# EAGLE design board (EAGLE 7.7.0)
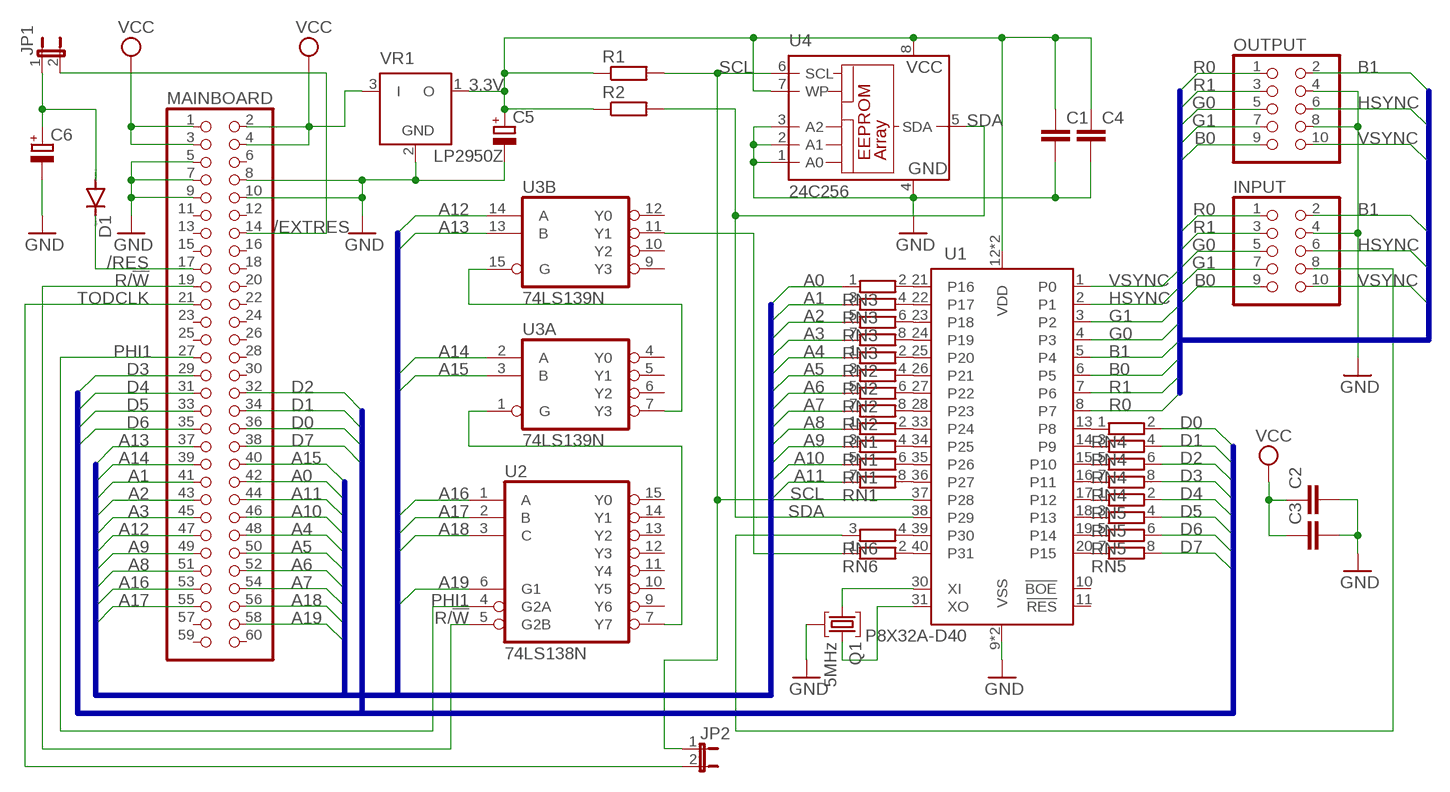
[diagram p0: schematic, sheet 1]

## Parts
C1  C2.5/2  [C2.5-2]
C2  C2.5/2  [C2.5-2]
C3  C2.5/2  [C2.5-2]
C4  C2.5/2  [C2.5-2]
C5  CPOL-EUE5-6  [E5-6]
C6  CPOL-EUE5-6  [E5-6]
D1  1N4148DO35-7  [DO35-7]
INPUT  PINHD-2X5  [2X05]
JP1  JP1E  [JP1]
JP2  JP1E  [JP1]
MAINBOARD  PINHD-2X30  [2X30]
OUTPUT  PINHD-2X5  [2X05]
Q1  5MHz  16M20AUM1  [UM1]
R1  R-EU_0204/7  [0204/7]
R2  R-EU_0204/7  [0204/7]
RN1  E4RP  [SIL8]
RN2  E4RP  [SIL8]
RN3  E4RP  [SIL8]
RN4  E4RP  [SIL8]
RN5  E4RP  [SIL8]
RN6  E4RP  [SIL8]
U1  P8X32A-D40  [DIL40]
U2  74LS138N  [DIL16]
U3  74LS139N  [DIL16]
U4  24C256  24C64P  [DIL8]
VR1  LP2950Z  [TO92]

## Nets
3.3V [power]: C1.1 C4.1 C5.+ R1.1 R2.1 U1.12(VDD) U1.32(VDD) U4.7(WP) U4.8(VCC) VR1.1(O)
/EXTRES: JP1.2 MAINBOARD.14
/RES: D1.C MAINBOARD.17
A0: MAINBOARD.42 RN3.1
A1: MAINBOARD.41 RN3.3
A2: MAINBOARD.43 RN3.5
A3: MAINBOARD.45 RN3.7
A4: MAINBOARD.48 RN2.1
A5: MAINBOARD.50 RN2.3
A6: MAINBOARD.52 RN2.5
A7: MAINBOARD.54 RN2.7
A8: MAINBOARD.51 RN1.1
A9: MAINBOARD.49 RN1.3
A10: MAINBOARD.46 RN1.5
A11: MAINBOARD.44 RN1.7
A12: MAINBOARD.47 U3.14(B:A)
A13: MAINBOARD.37 U3.13(B:B)
A14: MAINBOARD.39 U3.2(A:A)
A15: MAINBOARD.40 U3.3(A:B)
A16: MAINBOARD.53 U2.1(A)
A17: MAINBOARD.55 U2.2(B)
A18: MAINBOARD.56 U2.3(C)
A19: MAINBOARD.58 U2.6(G1)
B0: INPUT.9 OUTPUT.9 U1.6(P5)
B1: INPUT.2 OUTPUT.2 U1.5(P4)
D0: MAINBOARD.36 RN4.2
D1: MAINBOARD.34 RN4.4
D2: MAINBOARD.32 RN4.6
D3: MAINBOARD.29 RN4.8
D4: MAINBOARD.31 RN5.2
D5: MAINBOARD.33 RN5.4
D6: MAINBOARD.35 RN5.6
D7: MAINBOARD.38 RN5.8
G0: INPUT.5 OUTPUT.5 U1.4(P3)
G1: INPUT.7 OUTPUT.7 U1.3(P2)
GND [power]: C1.2 C2.2 C3.2 C4.2 C5.- C6.- INPUT.4 MAINBOARD.5 MAINBOARD.7 MAINBOARD.8 MAINBOARD.9 MAINBOARD.10 OUTPUT.4 OUTPUT.8 Q1.2 U1.9(VSS) U1.29(VSS) U4.1(A0) U4.2(A1) U4.3(A2) U4.4(GND) VR1.2(GND)
HSYNC: INPUT.6 OUTPUT.6 U1.2(P1)
N$1: U2.7(Y7) U3.1(A:G)
N$2: U3.7(A:Y3) U3.15(B:G)
N$3: RN6.1 U3.11(B:Y1)
N$4: RN1.8 U1.36(P27)
N$5: RN1.6 U1.35(P26)
N$6: RN1.4 U1.34(P25)
N$7: RN1.2 U1.33(P24)
N$8: RN2.8 U1.28(P23)
N$9: RN2.6 U1.27(P22)
N$10: RN2.4 U1.26(P21)
N$11: RN2.2 U1.25(P20)
N$12: RN3.8 U1.24(P19)
N$13: RN3.6 U1.23(P18)
N$14: RN3.4 U1.22(P17)
N$15: RN3.2 U1.21(P16)
N$16: RN5.7 U1.20(P15)
N$17: RN5.5 U1.19(P14)
N$18: RN5.3 U1.18(P13)
N$19: RN5.1 U1.17(P12)
N$20: RN4.7 U1.16(P11)
N$21: RN4.5 U1.15(P10)
N$22: RN4.3 U1.14(P9)
N$23: RN4.1 U1.13(P8)
N$24: RN6.2 U1.40(P31)
N$25: RN6.4 U1.39(P30)
N$26: Q1.1 U1.30(XI)
N$27: Q1.3 U1.31(XO)
N$28: C6.+ D1.A JP1.1
N$29: INPUT.8 RN6.3
PHI1: MAINBOARD.27 U2.4(G2A)
R0: INPUT.1 OUTPUT.1 U1.8(P7)
R1: INPUT.3 OUTPUT.3 U1.7(P6)
R/!W: MAINBOARD.19 U2.5(G2B)
SCL: JP2.1 R1.2 U1.37(P28) U4.6(SCL)
SDA: R2.2 U1.38(P29) U4.5(SDA)
TODCLK: JP2.2 MAINBOARD.21
VCC [power]: C2.1 C3.1 MAINBOARD.1 MAINBOARD.2 MAINBOARD.3 MAINBOARD.4 VR1.3(I)
VSYNC: INPUT.10 OUTPUT.10 U1.1(P0)
Unconnected: MAINBOARD.6 MAINBOARD.11 MAINBOARD.12 MAINBOARD.13 MAINBOARD.15 MAINBOARD.16 MAINBOARD.18 MAINBOARD.20 MAINBOARD.22 MAINBOARD.23 MAINBOARD.24 MAINBOARD.25 MAINBOARD.26 MAINBOARD.28 MAINBOARD.30 MAINBOARD.57 MAINBOARD.59 MAINBOARD.60 RN6.5 RN6.6 RN6.7 RN6.8 U1.10(!BOE) U1.11(!RES) U2.9(Y6) U2.10(Y5) U2.11(Y4) U2.12(Y3) U2.13(Y2) U2.14(Y1) U2.15(Y0) U3.4(A:Y0) U3.5(A:Y1) U3.6(A:Y2) U3.9(B:Y3) U3.10(B:Y2) U3.12(B:Y0)

## Buses
ADDR:A[0..19]
DATA:D[0..7]
VGA:B[0..1],G[0..1],HSYNC,R[0..1],VSYNC

## Power pins joined to a net without a drawn wire
GND: U2.8(GND) U3.8(P:GND)
VCC: U2.16(VCC) U3.16(P:VCC)

## Library data of the parts
C1-C4 = capacitor-wima:C: CAPACITOR naming: grid - package width
C5 C6 = rcl:CPOL-EU: POLARIZED CAPACITOR, European symbol; SPICEPREFIX: C
D1 = diode:1N4148: DIODE high speed (Philips)
INPUT OUTPUT = pinhead:PINHD-2X5: PIN HEADER
JP1 JP2 = jumper:JP1E: JUMPER
MAINBOARD = pinhead:PINHD-2X30: PIN HEADER
Q1 = crystal:16M20AUM1: Monolithic Crystal Filters Source: www.vanlong.com; OC_FARNELL: unknown; OC_NEWARK: unknown
R1 R2 = resistor:R-EU_: RESISTOR, European symbol
RN1-RN6 = resistor-sil:E4RP: SIL RESISTOR; OC_FARNELL: unknown; OC_NEWARK: unknown
U1 = p8x32a_11:P8X32A-?: 8-Cog Multiprocessor Microcontroller Source: http://www.parallax.com/sites/default/files/downloads/P8X32A-Propeller-Datasheet-v1.4.0_0.pdf; MF: Parallax Semiconductor; MPN: P8X32A-D40; OC_FARNELL: 1263886; OC_NEWARK: 11X5686
U2 = 74xx-us:74*138: 3-line to 8-line DECODER/DEMULTIPLEXER
U3 = 74xx-us:74*139: Dual 2-line to 4-line DECODER/DEMULTIPLEXER
U4 = microchip:24*: Serial EEPROM I2C; MF: RAMTRON INTERNATIONAL CORP; MPN: FM24C64-P; OC_FARNELL: 1362657; OC_NEWARK: 97H6452
VR1 = linear:LP2950: 100 mA, Low Power Low Dropout Voltage Regulator Source: http://www.onsemi.com/pub/Collateral/LP2950-D.PDF

## Net classes
0 default: width 0.127 mm, drill 0.127 mm, clearance 0.127 mm
1 power: width 0.305 mm, drill 0.127 mm, clearance 0.127 mm

## Board
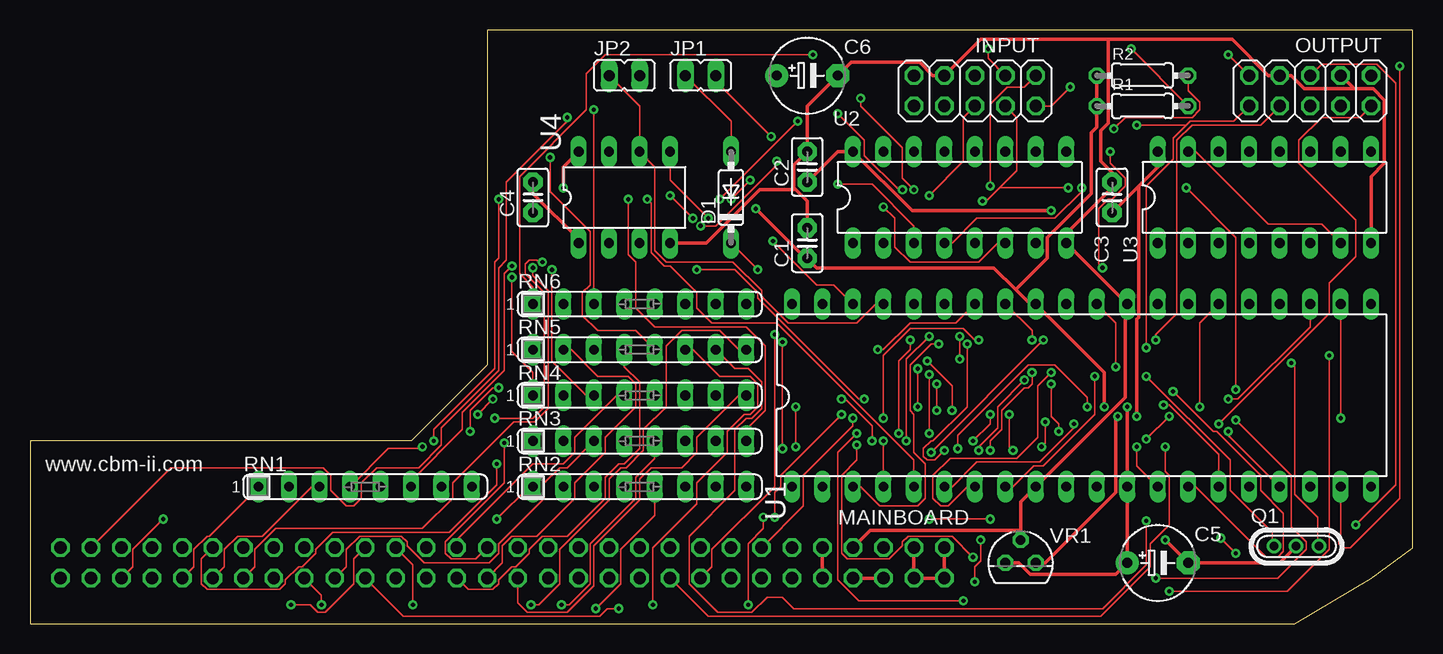
[diagram p1: board, top side]
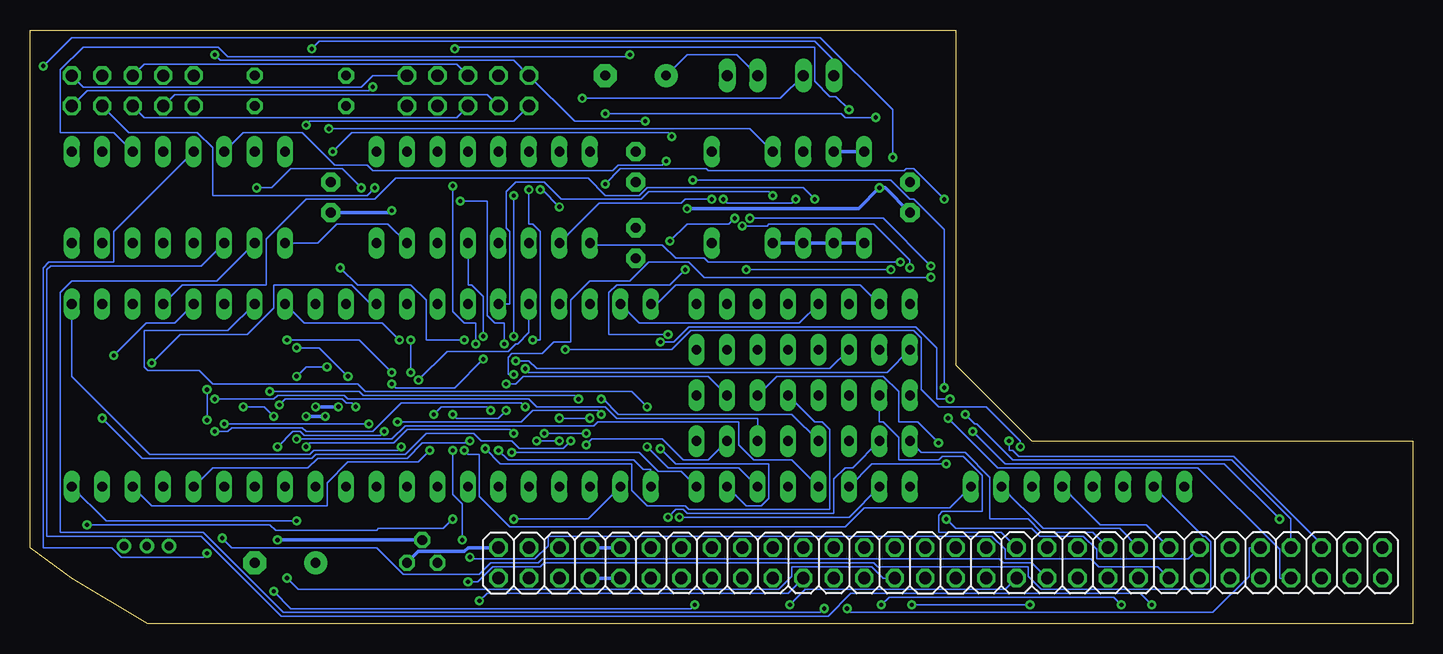
[diagram p2: board, bottom side, seen from below]

Size 115.24 x 49.52 mm. Coordinates in mm from the lower left corner, seen from the top.
Outline: 0,0 105.41,0 111.76,3.81 115.24,6.35 115.24,49.52 38.1,49.52 38.1,21.59 31.75,15.24 0,15.24 0,0
Copper layers (1*16): Top 0.035mm / dielectric 1.5mm / Bottom 0.035mm
Design rules "default *": minimum track width 5mil, minimum drill 0.35mm, track to track 5mil, track to pad 5mil, pad to pad 5mil, via to via 5mil, smd to smd 5mil, copper to edge 20mil, drill to drill 5mil, minimum pad ring 10mil, minimum via ring 8mil, stop-mask expansion 4mil, vias tented up to drill 0mil, thermal gap 10mil

### Footprints (pad centres in the part's own frame; a part is rotated, then mirrored left to right if it is on the bottom)
C2.5-2 = drill 0.813 pad 1.6 octagon: 1 -1.27,0; 2 1.27,0
E5-6 = drill 0.813 pad 1.905: + -2.54,0 | drill 0.813 pad 1.905 octagon: - 2.54,0
DO35-7 = drill 0.813 long: A 3.81,0; C -3.81,0
2X05 = drill 1.016 octagon: 1 -5.08,-1.27; 2 -5.08,1.27; 3 -2.54,-1.27; 4 -2.54,1.27; 5 0,-1.27; 6 0,1.27; 7 2.54,-1.27; 8 2.54,1.27; 9 5.08,-1.27; 10 5.08,1.27
JP1 = drill 0.914 long: 1 0,-1.27; 2 0,1.27
2X30 = drill 1.016 octagon: 1 -38.1,-1.27; 2 -38.1,1.27; 3 -35.56,-1.27; 4 -35.56,1.27; 5 -33.02,-1.27; 6 -33.02,1.27; 7 -30.48,-1.27; 8 -30.48,1.27; 9 -27.94,-1.27; 10 -27.94,1.27; 11 -25.4,-1.27; 12 -25.4,1.27; 13 -22.86,-1.27; 14 -22.86,1.27; 15 -20.32,-1.27; 16 -20.32,1.27; 17 -17.78,-1.27; 18 -17.78,1.27; 19 -15.24,-1.27; 20 -15.24,1.27; 21 -12.7,-1.27; 22 -12.7,1.27; 23 -10.16,-1.27; 24 -10.16,1.27; 25 -7.62,-1.27; 26 -7.62,1.27; 27 -5.08,-1.27; 28 -5.08,1.27; 29 -2.54,-1.27; 30 -2.54,1.27; 31 0,-1.27; 32 0,1.27; 33 2.54,-1.27; 34 2.54,1.27; 35 5.08,-1.27; 36 5.08,1.27; 37 7.62,-1.27; 38 7.62,1.27; 39 10.16,-1.27; 40 10.16,1.27; 41 12.7,-1.27; 42 12.7,1.27; 43 15.24,-1.27; 44 15.24,1.27; 45 17.78,-1.27; 46 17.78,1.27; 47 20.32,-1.27; 48 20.32,1.27; 49 22.86,-1.27; 50 22.86,1.27; 51 25.4,-1.27; 52 25.4,1.27; 53 27.94,-1.27; 54 27.94,1.27; 55 30.48,-1.27; 56 30.48,1.27; 57 33.02,-1.27; 58 33.02,1.27; 59 35.56,-1.27; 60 35.56,1.27
UM1 = drill 0.7 pad 1.2: 1 -1.875,0; 2 -0.027,0; 3 1.875,0
0204/7 = drill 0.813 octagon: 1 -3.81,0; 2 3.81,0
SIL8 = drill 0.813 long: 1 -8.89,0; 2 -6.35,0; 3 -3.81,0; 4 -1.27,0; 5 1.27,0; 6 3.81,0; 7 6.35,0; 8 8.89,0
DIL40 = drill 0.813 long: 1 -22.86,-7.62; 2 -20.32,-7.62; 3 -17.78,-7.62; 4 -15.24,-7.62; 5 -12.7,-7.62; 6 -10.16,-7.62; 7 -7.62,-7.62; 8 -5.08,-7.62; 9 -2.54,-7.62; 10 0,-7.62; 11 2.54,-7.62; 12 5.08,-7.62; 13 7.62,-7.62; 14 10.16,-7.62; 15 12.7,-7.62; 16 15.24,-7.62; 17 17.78,-7.62; 18 20.32,-7.62; 19 22.86,-7.62; 20 25.4,-7.62; 21 25.4,7.62; 22 22.86,7.62; 23 20.32,7.62; 24 17.78,7.62; 25 15.24,7.62; 26 12.7,7.62; 27 10.16,7.62; 28 7.62,7.62; 29 5.08,7.62; 30 2.54,7.62; 31 0,7.62; 32 -2.54,7.62; 33 -5.08,7.62; 34 -7.62,7.62; 35 -10.16,7.62; 36 -12.7,7.62; 37 -15.24,7.62; 38 -17.78,7.62; 39 -20.32,7.62; 40 -22.86,7.62
DIL16 = drill 0.813 long: 1 -8.89,-3.81; 2 -6.35,-3.81; 3 -3.81,-3.81; 4 -1.27,-3.81; 5 1.27,-3.81; 6 3.81,-3.81; 7 6.35,-3.81; 8 8.89,-3.81; 9 8.89,3.81; 10 6.35,3.81; 11 3.81,3.81; 12 1.27,3.81; 13 -1.27,3.81; 14 -3.81,3.81; 15 -6.35,3.81; 16 -8.89,3.81
DIL8 = drill 0.813 long: 1 -3.81,-3.81; 2 -1.27,-3.81; 3 1.27,-3.81; 4 3.81,-3.81; 5 3.81,3.81; 6 1.27,3.81; 7 -1.27,3.81; 8 -3.81,3.81
TO92 = drill 0.813 octagon: 1 -1.27,0; 2 0,1.905; 3 1.27,0

### Placement (x,y rotation side)
C1  64.77,31.75 90 top
C2  64.77,38.1 90 top
C3  90.17,35.56 90 top
C4  41.91,35.56 90 top
C5  93.98,5.08 0 top
C6  64.77,45.72 0 top
D1  58.42,35.56 90 top
INPUT  78.74,44.45 0 top
JP1  55.88,45.72 270 top
JP2  49.53,45.72 270 top
MAINBOARD  38.1,5.08 0 bottom
OUTPUT  106.68,44.45 0 top
Q1  105.54,6.48 0 top
R1  92.71,43.18 0 top
R2  92.71,45.72 0 top
RN1  27.94,11.43 0 top
RN2  50.8,11.43 0 top
RN3  50.8,15.24 0 top
RN4  50.8,19.05 0 top
RN5  50.8,22.86 0 top
RN6  50.8,26.67 0 top
U1  86.36,19.05 0 top
U2  77.47,35.56 0 top
U3  102.87,35.56 0 top
U4  49.53,35.56 0 top
VR1  82.55,5.08 0 top

### Tracks (layer width: path | path; a pad name or v marks a point on that pad's centre or on a via)
3.3V  (via drill 0.35)
  Top 0.305: VR1.1 82.39,5.08 83.34,4.13 90.49,4.13 C5.+ U1.12 v91.44,18.1 | v44.45,36.35 44.45,38.1 U4.8 | R2.1 R1.1 88.9,41.43 88.42,40.96 88.42,35.88 84.77,32.23 84.77,30.48 82.15,27.86 | 82.15,27.86 80.33,29.69 65.56,29.69 C1.1 64.77,30.32 v60.48,34.61 | 82.15,27.86 83.34,26.67 U1.32 89.53,20.95 v89.53,18.1
  Bottom 0.305: U4.7 U4.8 | C4.1 43.97,36.35 v44.45,36.35 46.2,34.61 v60.48,34.61 | v89.53,18.1 v91.44,18.1
/EXTRES  (via drill 0.35)
  Top 0.127: JP1.2 57.15,45.24 v61.75,40.64 | v90.01,39.37 90.01,38.42 91.28,37.15 91.28,36.51 90.17,35.4 89.85,35.4 89.06,34.61 89.06,30 v89.38,29.69 | v79.06,23.65 78.74,23.65 77.79,24.61 73.34,24.61 71.12,22.38 v71.12,17.14 | v68.58,17.14 68.58,16.51 64.45,12.38 64.45,9.84 MAINBOARD.14
  Bottom 0.127: v61.75,40.64 62.07,40.96 88.42,40.96 v90.01,39.37 | v89.38,29.69 87.95,28.26 83.5,28.26 82.23,26.99 82.23,23.65 v79.06,23.65 | v68.58,17.14 v71.12,17.14
/RES  (via drill 0.35)
  Top 0.127: v60.64,29.53 D1.C | v62.07,24.13 62.07,11.43 56.83,6.19 56.83,4.76 MAINBOARD.17
  Bottom 0.127: v60.64,29.53 61.91,28.26 66.36,28.26 66.99,27.62 66.99,24.13 v62.07,24.13
A0
  Bottom 0.127: RN3.1 40.96,14.29 37.31,14.29 35.24,12.22 35.24,8.73 32.07,8.73 30.96,7.62 26.67,7.62 MAINBOARD.42
A1
  Top 0.127: RN3.3 44.77,13.02 44.13,13.02 42.86,11.75 42.86,10.48 39.05,6.67 39.05,5.87 38.26,5.08 32.86,5.08 31.43,6.51 31.43,6.83 30.96,7.3 27.46,7.3 26.35,6.19 26.35,4.76 MAINBOARD.41
A2  (via drill 0.35)
  Top 0.127: RN3.5 52.07,13.81 50.48,12.22 50.48,10.48 46.67,6.67 46.67,3.33 44.93,1.59 v44.29,1.59 | v24.29,1.59 24.29,2.38 MAINBOARD.43
  Bottom 0.127: v44.29,1.59 43.66,2.22 24.92,2.22 v24.29,1.59
A3  (via drill 0.35)
  Top 0.127: v68.9,14.92 68.9,13.65 67.63,12.38 67.63,5.87 68.1,5.4 71.6,5.4 72.71,6.51 72.71,6.83 73.18,7.3 76.83,7.3 v78.58,5.56
  Bottom 0.127: RN3.7 58.74,13.65 60.8,13.65 62.55,15.4 68.42,15.4 v68.9,14.92 | v78.58,5.56 78.42,5.4 73.18,5.4 72.07,6.51 72.07,7.3 35.08,7.3 33.97,6.19 33.97,5.4 26.83,5.4 26.19,4.76 21.27,4.76 MAINBOARD.45
A4  (via drill 0.35)
  Top 0.127: RN2.1 41.59,11.43 v38.89,8.73
  Bottom 0.127: v38.89,8.73 38.1,7.94 31.75,7.94 31.11,7.3 27.46,7.3 26.35,6.19 26.35,5.4 18.73,5.4 MAINBOARD.48
A5  (via drill 0.35)
  Top 0.127: v38.89,13.33 38.89,11.59 34.92,7.62 25.24,7.62 23.81,6.19 23.81,5.87 22.7,4.76 22.38,4.76 21.27,3.65 21.27,3.33 20.8,2.86 14.76,2.86 14.29,3.33 14.29,5.4 MAINBOARD.50
  Bottom 0.127: RN2.3 45.09,13.33 v38.89,13.33
A6  (via drill 0.35)
  Top 0.127: RN2.5 52.07,9.05 49.21,6.19 49.21,3.33 v47.15,1.27
  Bottom 0.127: v47.15,1.27 46.83,0.95 16.67,0.95 13.65,3.97 13.65,6.35 MAINBOARD.52
A7  (via drill 0.35)
  Top 0.127: v62.71,23.5 v62.71,14.61 | v37.31,17.46 v38.58,18.73
  Bottom 0.127: RN2.7 55.56,9.84 54.29,9.84 53.66,10.48 53.66,13.33 61.44,13.33 v62.71,14.61 | v62.71,23.5 61.59,23.5 60.33,24.77 41.43,24.77 39.69,23.02 39.69,18.73 v38.58,18.73 | v37.31,17.46 36.51,16.67 36.35,16.67 33.34,13.65 15.08,13.65 10.16,8.73 MAINBOARD.54
A8
  Top 0.127: RN1.1 14.92,7.3 14.76,7.3 13.65,6.19 13.65,4.76 MAINBOARD.51
A9
  Top 0.127: RN1.3 23.5,11.43 19.37,7.3 17.3,7.3 16.19,6.19 16.19,4.76 MAINBOARD.49
A10
  Bottom 0.127: RN1.5 26.04,8.26 22.23,8.26 MAINBOARD.46
A11
  Bottom 0.127: RN1.7 30.8,7.94 24.45,7.94 MAINBOARD.44
A12  (via drill 0.35)
  Top 0.127: v62.23,38.58 62.23,38.26 57.15,33.18 v55.88,33.18 | v41.91,29.69 41.91,29.05 43.18,27.78 43.18,17.94 42.07,16.83 40.32,16.83 35.24,11.75 35.24,10.48 32.7,7.94 20.48,7.94 18.73,6.19 18.73,4.76 MAINBOARD.47
  Bottom 0.127: U3.14 97.47,40.96 92.55,40.96 89.85,38.26 87.15,38.26 86.68,37.78 66.67,37.78 66.2,38.26 62.55,38.26 v62.23,38.58 | v55.88,33.18 53.82,33.18 53.66,33.34 44.93,33.34 41.91,30.32 v41.91,29.69
A13  (via drill 0.35)
  Top 0.127: v99.22,7.14 v100.49,5.87
  Bottom 0.127: U3.13 108.27,32.7 108.27,30.16 113.67,30.16 114.14,29.69 114.14,6.35 108.43,6.35 107.63,5.56 100.81,5.56 v100.49,5.87 | v99.22,7.14 98.42,6.35 86.36,6.35 84.14,4.13 77.79,4.13 76.83,5.08 72.87,5.08 72.55,5.4 34.45,5.4 34.13,5.08 31.75,5.08 MAINBOARD.37
A14  (via drill 0.35)
  Top 0.127: v49.05,1.27 48.1,1.27 47.47,0.64 31.11,0.64 MAINBOARD.39
  Bottom 0.127: U3.2 99.69,28.57 111.76,28.57 112.71,27.62 112.71,7.62 100.81,7.62 94.14,0.95 49.37,0.95 v49.05,1.27
A15  (via drill 0.35)
  Top 0.127: v21.75,1.59 23.34,1.59 23.97,0.95 24.61,0.95 26.99,3.33 26.99,5.4 MAINBOARD.40
  Bottom 0.127: U3.3 100.97,29.84 113.51,29.84 113.82,29.53 113.82,7.3 100.97,7.3 94.3,0.64 48.74,0.64 46.83,2.54 22.7,2.54 v21.75,1.59
A16  (via drill 0.35)
  Top 0.127: v42.7,30.16 42.39,30.16 42.23,30.32 41.59,30.32 41.27,30 41.27,29.21 42.86,27.62 42.86,18.1 41.91,17.14 v38.73,17.14
  Bottom 0.127: U2.1 68.42,31.59 62.55,31.59 61.44,30.48 59.05,30.48 58.74,30.16 v42.7,30.16 | v38.73,17.14 34.61,13.02 17.94,13.02 11.11,6.19 11.11,3.81 MAINBOARD.53
A17  (via drill 0.35)
  Top 0.127: v60.01,36.99 v58.42,35.4 | v39.05,19.68 38.58,19.68 36.67,17.78 v36.67,16.03 | v11.11,8.73 8.57,6.19 8.57,4.76 MAINBOARD.55
  Bottom 0.127: U2.2 67.79,35.08 60.96,35.08 60.64,35.4 v58.42,35.4 | v60.01,36.99 43.5,36.99 41.91,35.4 41.59,35.4 39.05,32.86 v39.05,19.68 | v36.67,16.03 33.97,13.33 15.72,13.33 v11.11,8.73
A18  (via drill 0.35)
  Top 0.127: U2.3 73.66,33.18 70.17,36.67 v67.31,36.67 | v39.05,35.4 39.05,30.48 38.73,30.16 38.73,21.27 33.66,16.19 v33.66,15.24
  Bottom 0.127: v67.31,36.67 66.04,37.94 58.9,37.94 58.74,37.78 42.39,37.78 42.23,37.94 41.59,37.94 v39.05,35.4 | v33.66,15.24 33.66,14.45 33.34,14.45 32.86,13.97 14.92,13.97 7.62,6.67 MAINBOARD.56
A19  (via drill 0.35)
  Top 0.127: U2.6 80.64,31.75 79.06,30.16 73.34,30.16 72.07,31.43 72.07,33.81 v71.12,34.77 | v72.71,36.2 72.39,36.2 69.53,39.05 69.53,40.32 v67.31,42.55 | v44.77,42.23 44.77,41.91 39.69,36.83 39.69,30.32 39.05,29.69 39.05,21.11 34.29,16.35 34.29,14.92 32.38,13.02 28.89,13.02 27.62,11.75 27.62,10.48 26.99,9.84 26.35,9.84 25.08,11.11 25.08,12.38 24.45,13.02 11.75,13.02 MAINBOARD.58
  Bottom 0.127: v71.12,34.77 72.55,36.2 v72.71,36.2 | v67.31,42.55 47.62,42.55 47.31,42.23 v44.77,42.23
B0  (via drill 0.35)
  Top 0.127: U1.6 76.83,11.43 78.9,13.49 84.14,13.49 87,16.35 v87,16.67 | v99.06,16.67 108.27,25.88 108.27,28.42 110.49,30.64 110.49,33.66 105.73,38.42 105.73,40.32 107.63,42.23 110.81,42.23 OUTPUT.9 | INPUT.9 85.09,43.18 v86.68,44.77
  Bottom 0.127: v99.06,16.67 v87,16.67 | v86.68,44.77 87,44.45 110.49,44.45 OUTPUT.9
B1  (via drill 0.35)
  Top 0.127: U1.5 73.66,13.65 62.23,25.08 56.83,25.08 55.56,26.35 55.56,27.62 53.34,29.84 52.86,29.84 51.75,30.96 51.75,35.08 v51.44,35.4 | v63.98,41.91 v57.47,35.4 | v99.85,47.47 OUTPUT.2
  Bottom 0.127: v51.44,35.4 51.75,35.08 57.15,35.08 v57.47,35.4 | v63.98,41.91 69.85,41.91 INPUT.2 74.93,46.99 99.38,46.99 v99.85,47.47
D0
  Bottom 0.127: RN4.2 44.45,16.83 44.13,16.83 42.86,15.56 42.86,13.65 39.53,13.65 39.21,13.97 37.47,13.97 35.88,12.38 35.88,9.37 39.21,9.37 39.53,9.05 39.53,7.62 34.29,7.62 MAINBOARD.36
D1
  Top 0.127: RN4.4 48.9,19.05 45.4,15.56 45.4,14.29 44.45,13.33 41.91,13.33 35.56,6.98 MAINBOARD.34
D2  (via drill 0.35)
  Top 0.127: v39.53,15.08 39.53,11.75 34.61,6.83 34.61,5.87 35.08,5.4 37.15,5.4 MAINBOARD.32
  Bottom 0.127: RN4.6 53.02,20.64 44.13,20.64 42.86,19.37 42.86,16.83 41.27,16.83 v39.53,15.08
D3
  Top 0.127: RN4.8 59.05,19.05 55.56,15.56 55.56,14.29 54.29,13.02 51.75,13.02 50.8,12.06 50.8,10.32 46.99,6.51 46.99,3.17 44.77,0.95 41.43,0.95 40.64,1.75 MAINBOARD.29
D4
  Top 0.127: RN5.2 45.09,22.86 47.31,20.64 49.85,20.64 50.48,20 50.48,18.1 47.94,15.56 47.94,14.29 45.4,11.75 45.4,10.48 42.23,7.3 40.16,7.3 39.37,6.51 39.37,5.08 MAINBOARD.31
D5
  Top 0.127: RN5.4 49.53,21.43 50.8,20.16 50.8,14.61 49.53,13.33 49.05,13.33 47.94,12.22 47.94,10.48 44.77,7.3 42.7,7.3 41.59,6.19 41.59,5.87 40.48,4.76 40.16,4.76 39.05,3.65 39.05,3.33 38.58,2.86 36.51,2.86 MAINBOARD.33
D6  (via drill 0.35)
  Top 0.127: RN5.6 55.24,22.86 57.47,20.64 60.01,20.64 60.64,20 60.64,18.1 60.01,17.46 59.53,17.46 58.1,16.03 58.1,14.29 55.56,11.75 55.56,10 51.91,6.35 v51.91,1.59
  Bottom 0.127: v51.91,1.59 50.64,2.86 33.97,2.86 MAINBOARD.35
D7  (via drill 0.35)
  Top 0.127: RN5.8 59.05,22.86 57.47,24.45 54.29,24.45 53.02,23.18 53.02,18.1 51.12,16.19 51.12,14.45 49.69,13.02 49.21,13.02 48.26,12.06 48.26,10.32 44.13,6.19 44.13,3.33 42.39,1.59 v41.75,1.59 | v31.91,1.59 31.91,4.92 MAINBOARD.38
  Bottom 0.127: v31.91,1.59 v41.75,1.59
G0  (via drill 0.35)
  Top 0.127: v71.12,15.24 U1.4 | v73.03,15.24 73.03,22.07 v74.93,23.97 | v74.93,35.72 77.79,38.58 77.79,42.23 INPUT.5
  Bottom 0.127: v73.03,15.24 v71.12,15.24 | v74.93,35.72 v74.93,23.97 | OUTPUT.5 105.73,42.23 79.69,42.23 INPUT.5
G1  (via drill 0.35)
  Top 0.127: U1.3 69.22,11.43 70.8,9.84 73.98,9.84 74.61,10.48 74.61,13.33 73.66,14.29 73.66,17.46 73.34,17.78 73.34,21.59 75.09,23.34 v75.72,23.34 | v79.38,35.24 79.69,35.24 80.8,36.35 | 80.8,36.35 82.23,37.78 82.23,42.23 INPUT.7 | 80.8,36.35 v86.52,36.35
  Bottom 0.127: v75.72,23.34 75.72,25.08 76.52,25.08 77.15,25.72 77.15,35.24 v79.38,35.24 | OUTPUT.7 107,40.96 101.28,40.96 100.01,39.69 100.01,35.72 87.15,35.72 v86.52,36.35
GND  (via drill 0.35)
  Top 0.305: Q1.2 105.41,6.35 104.14,5.08 C5.- v94.61,6.98 | 82.55,7.78 82.55,10.16 U1.9 91.28,18.89 91.28,26.67 U1.29 U2.8 86.52,31.75 86.52,32.7 90.17,36.35 C3.2 90.17,37.62 89.22,38.58 89.22,41.12 89.85,41.75 89.85,48.74 | 82.55,7.78 VR1.2 | MAINBOARD.5 MAINBOARD.7 | MAINBOARD.10 MAINBOARD.9 | 82.55,7.78 70.01,7.78 MAINBOARD.8 | U3.8 111.76,37.31 112.87,38.42 112.87,43.66 111.92,44.61 110.33,44.61 110.25,44.69 | OUTPUT.8 110.25,44.69 | 110.25,44.69 110.17,44.61 106.2,44.61 105.09,45.72 OUTPUT.4 103.19,45.72 100.17,48.74 89.85,48.74 | C4.2 41.91,35.88 45.72,32.07 U4.1 | C1.2 64.77,35.24 63.74,36.27 | 63.74,36.27 63.66,36.35 63.66,38.26 C2.2 64.77,43.18 C6.- 68.42,46.83 74.14,46.83 75.25,45.72 INPUT.4 79.22,48.74 89.85,48.74 | U4.4 56.36,31.75 60.8,36.2 63.66,36.2 63.74,36.27
  Bottom 0.305: MAINBOARD.10 MAINBOARD.8 | MAINBOARD.9 MAINBOARD.7 | VR1.2 v94.61,6.98 | U4.1 U4.2 U4.3 U4.4
HSYNC  (via drill 0.35)
  Top 0.127: v80.01,8.73 v74.93,8.73 | v110.49,8.26 113.82,11.59 113.82,45.09 112.24,46.67 107.63,46.67 OUTPUT.6
  Bottom 0.127: U1.2 68.74,8.73 v74.93,8.73 | v80.01,8.73 80.8,7.94 86.2,7.94 86.36,7.78 94.77,7.78 95.25,8.26 v110.49,8.26 | INPUT.6 79.69,46.67 105.73,46.67 OUTPUT.6
N$1
  Bottom 0.127: U2.7 85.41,33.34 89.69,33.34 91.28,31.75 U3.1
N$2
  Top 0.127: U3.15 97.16,39.37 103.19,33.34 107.63,33.34 U3.7
N$3  (via drill 0.35)
  Top 0.127: RN6.1 41.91,28.1 40.8,29.21 40.8,37.31 46.35,42.86 46.35,45.88 47.94,47.47 v65.25,47.47
  Bottom 0.127: v65.25,47.47 65.41,47.31 98.74,47.31 99.54,48.1 110.81,48.1 112.71,46.2 112.71,40.96 108.27,40.96 U3.11
N$4  (via drill 0.35)
  Top 0.127: v79.06,14.45 79.06,14.76 80.64,16.35 80.64,18.1 v82.87,20.32
  Bottom 0.127: RN1.8 38.58,9.68 45.72,9.68 47.31,8.1 75.25,8.1 77.79,10.64 77.79,14.13 78.74,14.13 v79.06,14.45 | v82.87,20.32 80.49,22.7 75.41,22.7 74.77,23.34 74.61,23.34 73.66,24.29 U1.36
N$5  (via drill 0.35)
  Top 0.127: RN1.6 31.75,11.91 36.04,16.19 36.04,17.62 39.53,21.11 39.53,29.21 v40.16,29.84 | v53.34,35.72 v55.24,33.81
  Bottom 0.127: v40.16,29.84 44.13,33.81 v55.24,33.81 | v53.34,35.72 53.66,36.04 63.66,36.04 64.29,35.4 70.96,35.4 72.39,36.83 74.77,36.83 75.56,36.04 75.56,33.02 75.25,32.7 75.25,26.67 U1.35
N$6  (via drill 0.35)
  Top 0.127: RN1.4 29.84,14.61 32.54,14.61 v32.7,14.76 | v70.64,22.86 71.12,22.86 73.34,25.08 77.15,25.08 U1.34
  Bottom 0.127: v32.7,14.76 32.7,15.24 35.56,18.1 39.53,18.1 40.96,19.53 40.96,23.81 41.59,24.45 60.17,24.45 61.75,22.86 v70.64,22.86
N$7  (via drill 0.35)
  Top 0.127: v78.74,3.49 78.74,4.76 79.22,5.24 v79.22,6.98 | v80.01,14.45 80.01,15.24 80.96,16.19 80.96,17.78 82.87,19.68 83.19,19.68 83.5,20 v83.5,20.95 | v83.5,23.65 83.5,24.45 U1.33
  Bottom 0.127: RN1.2 17.46,7.3 17.3,7.3 16.83,6.83 16.83,2.86 30.96,2.86 32.07,3.97 32.07,4.76 44.61,4.76 44.93,5.08 72.39,5.08 72.71,4.76 76.68,4.76 77.95,3.49 v78.74,3.49 | v79.22,6.98 79.22,10 80.01,10.79 v80.01,14.45 | v83.5,23.65 v83.5,20.95
N$8  (via drill 0.35)
  Top 0.127: v84.45,23.65 v75.09,14.29
  Bottom 0.127: RN2.8 60.96,12.7 62.87,12.7 64.45,14.29 v75.09,14.29 | v84.45,23.65 85.88,25.08 92.39,25.08 U1.28
N$9  (via drill 0.35)
  Top 0.127: v63.82,18.1 v63.82,14.76
  Bottom 0.127: RN2.6 56.2,13.02 62.07,13.02 v63.82,14.76 | v63.82,18.1 65.09,19.37 87.31,19.37 87.95,20 100.01,20 101.12,21.11 105.41,21.11 105.73,21.43 105.73,24.45 98.74,24.45 U1.27
N$10  (via drill 0.35)
  Top 0.127: v94.93,17.3 v93.03,15.4 | v97.47,18.1 97.47,25.08 U1.26
  Bottom 0.127: RN2.4 51.75,13.65 54.93,13.65 56.2,14.92 56.2,16.83 67.94,16.83 68.26,16.51 83.98,16.51 85.09,15.4 v93.03,15.4 | v94.93,17.3 95.73,18.1 v97.47,18.1
N$11  (via drill 0.35)
  Top 0.127: v61.12,8.89 61.12,7.94 59.85,6.67 v59.85,1.59 | v94.93,2.7 104.78,2.7 108.27,6.19 v108.27,22.38
  Bottom 0.127: RN2.2 46.99,8.89 v61.12,8.89 | v59.85,1.59 60.17,1.27 93.5,1.27 v94.93,2.7 | v108.27,22.38 105.57,25.08 103.19,25.08 U1.25
N$12  (via drill 0.35)
  Top 0.127: RN3.8 59.69,16.19 61.28,17.78 61.28,23.18 59.69,24.77 52.07,24.77 50.48,26.35 50.48,30.16 49.85,30.8 v49.85,35.4
  Bottom 0.127: v49.85,35.4 50.8,36.35 63.82,36.35 64.45,35.72 67.31,35.72 68.74,37.15 84.77,37.15 86.52,35.4 92.23,35.4 95.57,32.07 95.57,28.26 102.55,28.26 U1.24
N$13  (via drill 0.35)
  Top 0.127: v99.85,18.73 100.65,18.73 106.68,24.77 U1.23
  Bottom 0.127: RN3.6 54.61,17.14 66.36,17.14 67.31,18.1 73.03,18.1 73.66,18.73 88.74,18.73 89.06,19.05 94.61,19.05 94.93,18.73 v99.85,18.73
N$14  (via drill 0.35)
  Top 0.127: v67.63,18.73 67.94,18.73 70.17,16.51 v70.17,15.24 | U1.22 v109.22,17.14
  Bottom 0.127: RN3.4 51.75,17.46 66.2,17.46 67.47,18.73 v67.63,18.73 | v70.17,15.24 70.8,14.61 74.45,14.61 75.09,15.24 77.63,15.24 78.26,15.88 82.23,15.88 83.98,14.13 91.44,14.13 91.76,13.81 105.89,13.81 v109.22,17.14
N$15  (via drill 0.35)
  Top 0.127: v62.07,8.89 62.07,10.95 62.55,11.43 62.55,12.38 v67.63,17.46 | v84.61,16.83 84.61,15.08 v84.3,14.76
  Bottom 0.127: RN3.2 46.67,13.02 47.31,13.02 48.26,12.06 48.26,9.21 60.48,9.21 60.8,9.53 61.44,9.53 v62.07,8.89 | v67.63,17.46 67.94,17.78 73.34,17.78 74.3,16.83 v84.61,16.83 | v84.3,14.76 84.61,14.45 91.6,14.45 91.92,14.13 105.25,14.13 111.76,20.64 U1.21
N$16  (via drill 0.35)
  Top 0.127: v93.03,8.57 93.03,4.92 89.38,1.27 63.66,1.27 62.71,2.22 61.44,2.22 60.17,0.95 57.31,0.95 54.93,3.33 54.93,7.3 58.74,11.11 58.74,16.19 59.69,17.14 60.17,17.14 60.96,17.94 60.96,20.16 59.85,21.27 58.74,21.27 RN5.7
  Bottom 0.127: U1.20 108.9,8.57 v93.03,8.57
N$17  (via drill 0.35)
  Top 0.127: U1.19 109.22,7.46 109.06,7.3 109.06,6.67 109.38,6.35 110.01,6.35 114.14,10.48 v114.14,46.51 | v43.34,38.89 43.34,36.04 46.67,32.7 46.67,28.26 46.04,27.62 46.04,25.72 47.31,24.45 50.48,24.45 RN5.5
  Bottom 0.127: v114.14,46.51 111.76,48.9 49.37,48.9 43.34,42.86 v43.34,38.89
N$18  (via drill 0.35)
  Top 0.127: v74.77,21.91 76.83,19.84 v76.83,17.78 | v81.6,17.46 81.6,14.76 v81.92,14.45
  Bottom 0.127: RN5.3 48.58,21.27 73.03,21.27 73.66,21.91 v74.77,21.91 | v76.83,17.78 77.15,18.1 80.96,18.1 v81.6,17.46 | v81.92,14.45 82.87,13.49 88.74,13.49 90.49,11.75 90.49,9.84 105.09,9.84 U1.18
N$19  (via drill 0.35)
  Top 0.127: v73.98,18.1 v73.98,21.27 | v99.85,16.03 99.85,15.72 U1.17
  Bottom 0.127: RN5.1 43.81,20.95 73.66,20.95 v73.98,21.27 | v73.98,18.1 74.3,18.41 84.3,18.41 86.68,16.03 92.23,16.03 92.55,16.35 98.42,16.35 98.74,16.03 v99.85,16.03
N$20  (via drill 0.35)
  Top 0.127: v75.56,17.78 v75.56,20 | v80.01,17.46 80.01,16.67 v78.58,15.24
  Bottom 0.127: RN4.7 58.74,20.64 74.14,20.64 74.77,20 v75.56,20 | v75.56,17.78 76.2,17.14 79.69,17.14 v80.01,17.46 | v78.58,15.24 78.74,15.08 82.55,15.08 83.82,13.81 91.28,13.81 92.08,13.02 100.01,13.02 U1.16
N$21  (via drill 0.35)
  Top 0.127: v77.31,14.61 77.31,15.72 83.19,21.59 85.41,21.59 88.11,18.89 v88.11,18.1 | v94.46,18.26 94.93,18.26 99.06,14.13 U1.15
  Bottom 0.127: RN4.5 49.85,16.83 49.21,16.83 48.58,16.19 48.58,9.53 60.33,9.53 60.64,9.84 63.82,9.84 65.09,11.11 65.09,13.33 76.04,13.33 v77.31,14.61 | v88.11,18.1 88.42,18.41 88.9,18.41 89.22,18.73 93.98,18.73 v94.46,18.26
N$22  (via drill 0.35)
  Top 0.127: U1.14 97.16,11.43 103.03,5.56 103.98,5.56 104.46,6.03 104.46,9.21 102.55,11.11 102.55,12.38 98.9,16.03 98.58,16.03 v95.25,19.37 | v69.53,18.73 69.06,18.73 60.64,27.15 60.64,27.62 58.74,29.53 v55.56,29.53 | v43.5,29.53 43.5,21.91 46.35,19.05 RN4.3
  Bottom 0.127: v95.25,19.37 87.79,19.37 87.47,19.05 69.85,19.05 v69.53,18.73 | v43.5,29.53 v55.56,29.53
N$23  (via drill 0.35)
  Top 0.127: RN4.1 41.91,20.95 40.16,22.7 v40.16,28.89 | v74.93,15.88 v74.93,20.8 | v92.23,14.76 92.23,13.18 U1.13
  Bottom 0.127: v40.16,28.89 59.05,28.89 60.33,30.16 63.66,30.16 65.25,28.57 68.58,28.57 70.17,26.99 70.17,23.5 71.6,23.5 72.55,22.54 75.09,22.54 75.41,22.22 75.41,20.8 v74.93,20.8 | v74.93,15.88 75.25,16.19 83.82,16.19 84.93,15.08 91.92,15.08 v92.23,14.76
N$24
  Bottom 0.127: RN6.2 46.04,28.26 61.44,28.26 63.02,26.67 U1.40
N$25
  Bottom 0.127: RN6.4 51.12,25.08 64.45,25.08 U1.39
N$26  (via drill 0.35)
  Top 0.127: v93.03,20.64 100.01,13.65 100.01,11.11 103.5,7.62 103.5,6.51 Q1.1 | v90.49,21.43 90.49,25.08 U1.30
  Bottom 0.127: v93.03,20.64 92.23,21.43 v90.49,21.43
N$27  (via drill 0.35)
  Top 0.127: v105.09,21.75 105.41,21.43 105.41,10.79 107.31,8.89 107.31,6.51 Q1.3
  Bottom 0.127: v105.09,21.75 102.71,24.13 97.16,24.13 94.93,26.35 94.93,28.26 88.42,28.26 86.84,26.67 U1.31
N$28
  Top 0.127: D1.A 58.42,41.91 JP1.1
  Bottom 0.127: C6.+ 60.48,47.47 56.36,47.47 JP1.1
N$29  (via drill 0.35)
  Top 0.127: v46.99,42.86 RN6.3 | v79.85,47.94 79.85,47.15 INPUT.8
  Bottom 0.127: v46.99,42.86 48.1,43.97 48.58,43.97 49.85,45.24 49.85,48.1 79.69,48.1 v79.85,47.94
PHI1  (via drill 0.35)
  Top 0.127: U2.4 76.83,31.75 78.9,33.81 85.41,33.81 87.63,36.04 v87.63,36.35 | v96.36,36.35 100.49,32.23 v100.49,19.53 | v100.49,16.99 105.09,12.38 105.09,8.1 106.36,6.83 106.36,6.19 103.98,3.81 v93.82,3.81
  Bottom 0.127: v87.63,36.35 89.22,37.94 93.5,37.94 95.09,36.35 v96.36,36.35 | v100.49,16.99 v100.49,19.53 | v93.82,3.81 92.87,2.86 52.86,2.86 51.75,3.97 51.75,4.76 45.09,4.76 44.13,3.81 MAINBOARD.27
R0  (via drill 0.35)
  Top 0.127: U1.8 81.92,11.43 83.66,13.18 84.45,13.18 88.74,17.46 v88.74,20.64 | v93.03,23.02 93.03,36.51 95.25,38.74 95.25,40.48 96.36,41.59 | 96.36,41.59 96.68,41.91 100.33,41.91 OUTPUT.1 | 96.36,41.59 v92.23,41.59
  Bottom 0.127: v88.74,20.64 91.12,23.02 v93.03,23.02 | INPUT.1 74.93,41.91 91.92,41.91 v92.23,41.59
R1  (via drill 0.35)
  Top 0.127: U1.7 78.11,11.43 76.52,9.84 75.88,9.84 75.25,10.48 75.25,12.38 76.68,13.81 82.23,13.81 83.98,15.56 83.98,19.84 v85.09,20.95 | v93.82,23.65 93.82,24.13 95.57,25.88 95.57,40.32 96.84,41.59 102.55,41.59 OUTPUT.3
  Bottom 0.127: v85.09,20.95 87.79,23.65 v93.82,23.65 | INPUT.3 77.15,44.13 103.19,44.13 OUTPUT.3
R/!W  (via drill 0.35)
  Top 0.127: v77.47,22.07 v77.47,23.97 | v85.09,20 85.09,17.3 85.72,16.67 v85.72,16.03 | v94.61,14.76 94.61,12.7 94.93,12.38 94.93,8.26 93.34,6.67 93.34,4.76 89.22,0.64 56.52,0.64 MAINBOARD.19
  Bottom 0.127: U2.5 78.74,28.26 78.42,28.26 77.47,27.3 v77.47,23.97 | v77.47,22.07 79.85,19.68 84.77,19.68 v85.09,20 | v85.72,16.03 86.04,15.72 92.39,15.72 92.71,16.03 93.34,16.03 v94.61,14.76
SCL  (via drill 0.35)
  Top 0.127: JP2.1 50.8,43.18 U4.6 52.07,38.1 52.07,31.11 53.02,30.16 58.58,30.16 60.96,27.78 60.96,27.3 63.18,25.08 68.9,25.08 70.48,26.67 U1.37 | v91.76,47.94 R1.2
  Bottom 0.127: v91.76,47.94 91.12,48.58 49.85,48.58 48.26,46.99 JP2.1
SDA  (via drill 0.35)
  Top 0.127: U4.5 53.34,36.99 v56.52,33.81 | v61.91,31.91 65.56,28.26 66.99,28.26 U1.38 | R2.2 96.52,44.45 97.47,43.5 97.47,42.86 96.84,42.23 91.28,42.23 v90.33,41.28
  Bottom 0.127: v56.52,33.81 56.99,33.34 60.48,33.34 v61.91,31.91 | v90.33,41.28 55.24,41.28 U4.5
TODCLK  (via drill 0.35)
  Top 0.127: v69.22,43.82 69.22,43.18 72.71,39.69 72.71,37.15 v73.66,36.2 | v73.34,23.65 73.34,22.86 72.39,21.91 v72.39,15.88 | v68.9,15.88 67.31,14.29 67.31,3.65 69.06,1.91 v77.79,1.91
  Bottom 0.127: JP2.2 52.7,43.82 v69.22,43.82 | v73.66,36.2 73.66,33.34 73.34,33.34 72.71,32.7 72.71,23.65 v73.34,23.65 | v68.9,15.88 v72.39,15.88 | v77.79,1.91 77.15,2.54 52.07,2.54 MAINBOARD.21
VCC  (via drill 0.35)
  Top 0.305: MAINBOARD.4 MAINBOARD.3 MAINBOARD.1 MAINBOARD.2 | C2.1 67.31,39.37 U2.16 73.5,34.45 v85.09,34.45 | U3.16 93.98,38.1 92.31,36.43 | C3.1 92.31,36.43 | VR1.3 84.61,5.08 90.49,10.95 90.49,17.14 v90.65,17.3 | v92.23,17.3 92.23,25.4 92.39,25.56 92.39,36.35 92.31,36.43
  Bottom 0.305: VR1.3 82.87,6.03 79.06,6.03 78.74,6.35 MAINBOARD.2 | v85.09,34.45 85.25,34.29 C3.1 | v92.23,17.3 v90.65,17.3
VSYNC  (via drill 0.35)
  Top 0.127: v76.2,14.45 75.41,13.65 74.77,13.65 74.45,13.97 74.45,14.61 75.09,15.24 75.25,15.24 78.11,18.1 v78.11,23.34 | v80.01,36.51 80.01,43.34 81.44,44.77 82.87,44.77 INPUT.10
  Bottom 0.127: U1.1 63.5,12.86 64.14,12.86 64.93,13.65 75.41,13.65 v76.2,14.45 | v78.11,23.34 78.11,25.08 79.06,25.08 80.01,26.04 v80.01,36.51 | OUTPUT.10 110.81,44.77 87.63,44.77 86.68,45.72 INPUT.10

### Text on the board
tNames: www.cbm-ii.com